# EAGLE design Domino Pi No Teardrop (EAGLE 6.5.0)
Domino breakout Board
DATABASE: ./BOM/Domino_DB.txt; DRAWN: M.STEMPIN; REV: A
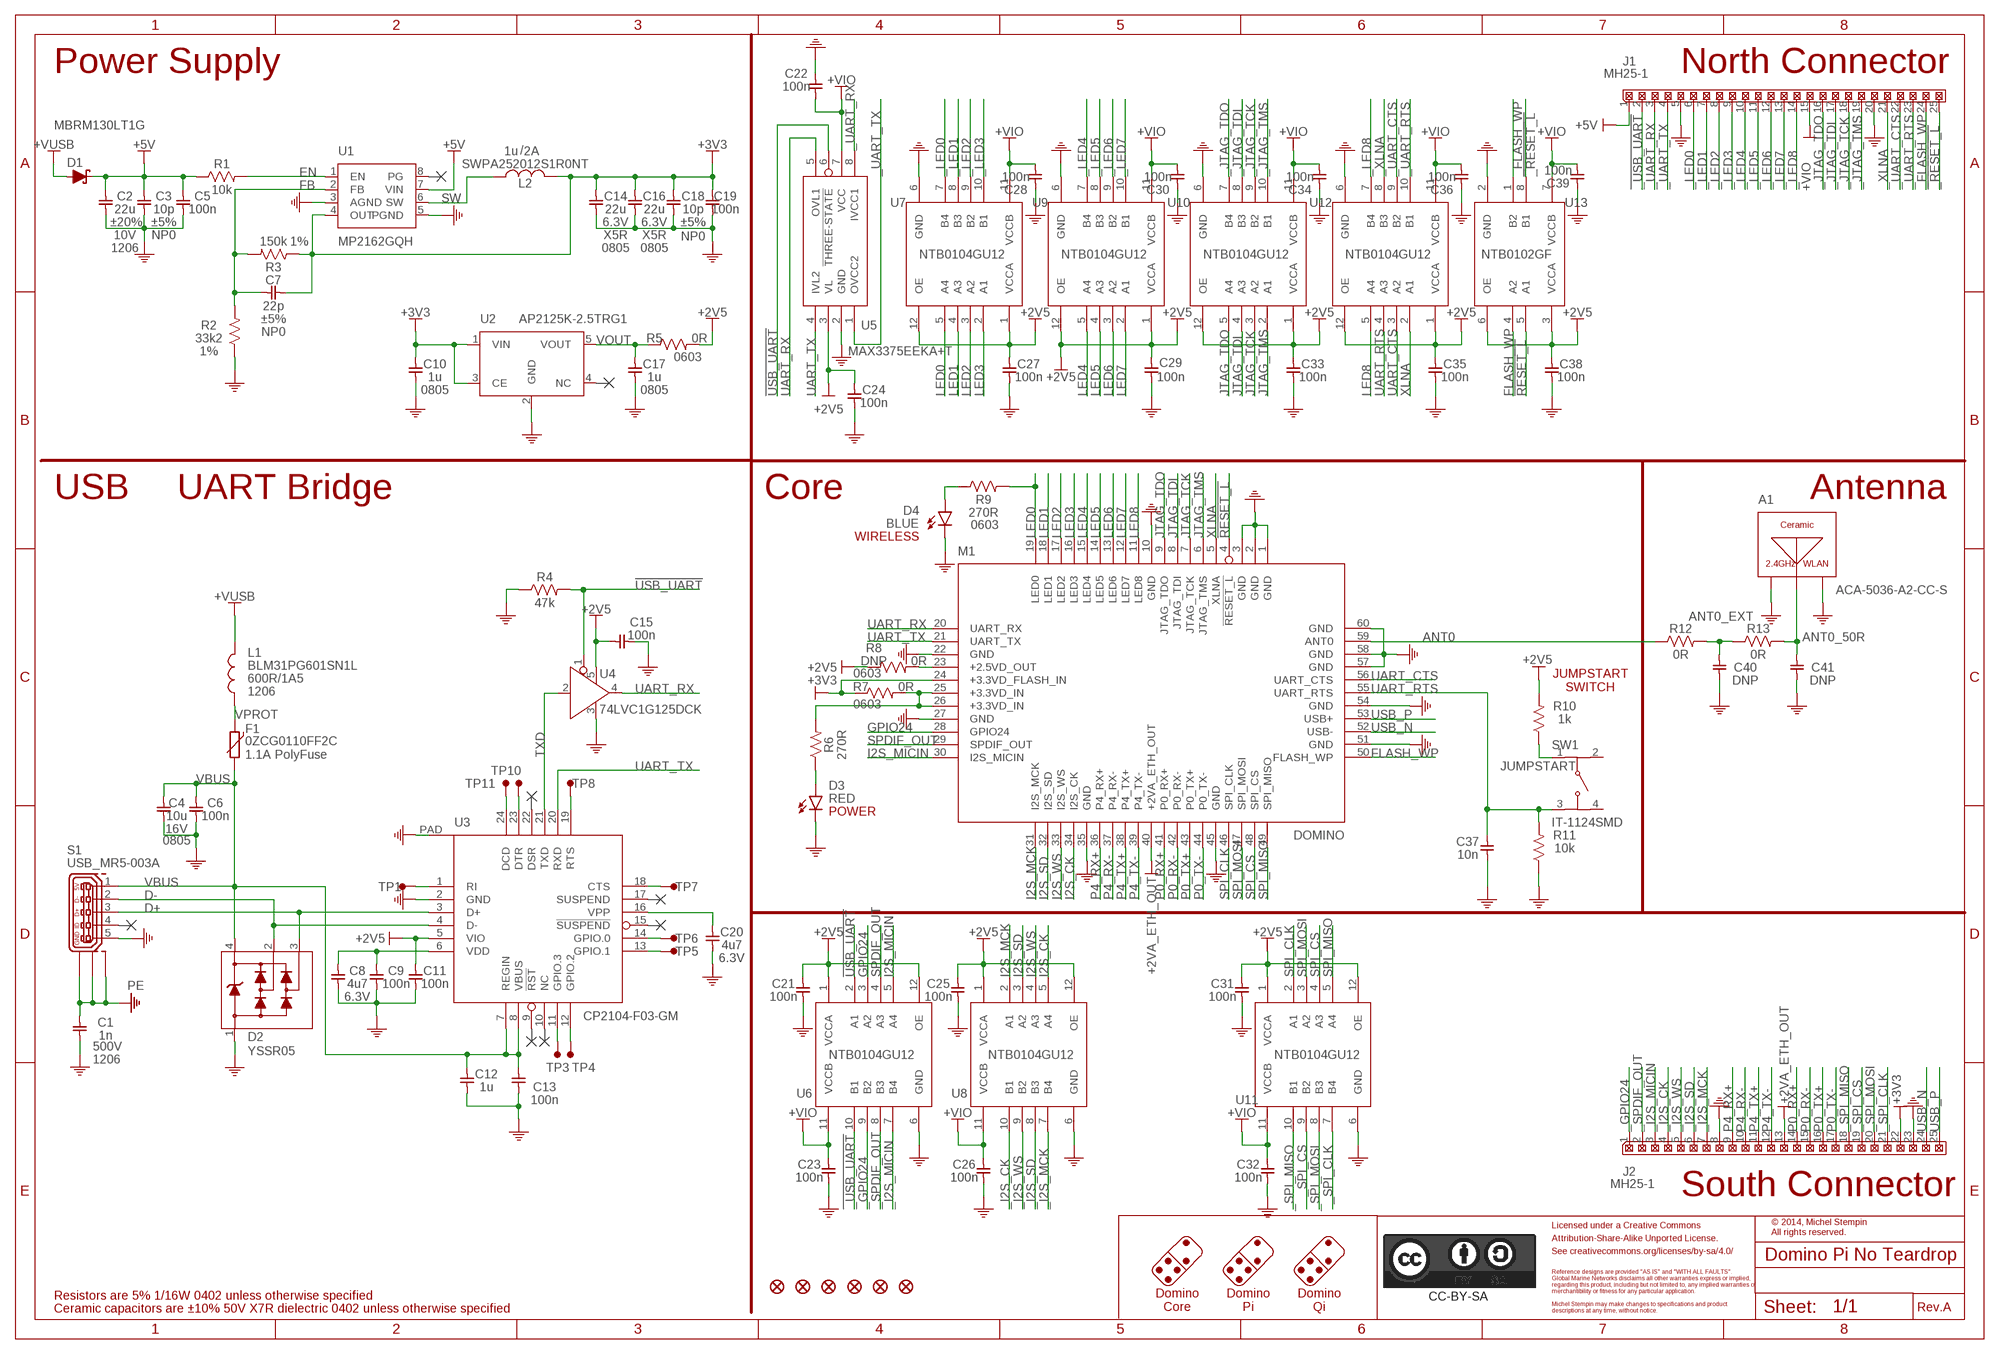
[diagram p0: schematic, sheet 1]
PORT1 (NC): BOM: EXCLUDE
PORT2 (NC): BOM: EXCLUDE
PORT3 (NC): BOM: EXCLUDE
PORT7 (NC): BOM: EXCLUDE
PORT8 (NC): BOM: EXCLUDE
PORT13 (NC): BOM: EXCLUDE
PORT16 (NC): BOM: EXCLUDE
PORT17 (NC): BOM: EXCLUDE

## Parts
A1  ACA-5036-A2-CC-S  [ACA-5036-A2-CC-S]
C1  1n  CAP_1206  [C1206]
C2  22u  CAP_1206  [C1206]
C3  10p  CAP_0402  [C0402]
C4  10u  CAP_0805  [C0805]
C5  100n  CAP_0402  [C0402]
C6  100n  CAP_0402  [C0402]
C7  22p  CAP_0402  [C0402]
C8  4u7  CAP_0402  [C0402]
C9  100n  CAP_0402  [C0402]
C10  1u  CAP_0805  [C0805]
C11  100n  CAP_0402  [C0402]
C12  1u  CAP_0402  [C0402]
C13  100n  CAP_0402  [C0402]
C14  22u  CAP_0805  [C0805]
C15  100n  CAP_0402  [C0402]
C16  22u  CAP_0805  [C0805]
C17  1u  CAP_0805  [C0805]
C18  10p  CAP_0402  [C0402]
C19  100n  CAP_0402  [C0402]
C20  4u7  CAP_0402  [C0402]
C21  100n  CAP_0402  [C0402]
C22  100n  CAP_0402  [C0402]
C23  100n  CAP_0402  [C0402]
C24  100n  CAP_0402  [C0402]
C25  100n  CAP_0402  [C0402]
C26  100n  CAP_0402  [C0402]
C27  100n  CAP_0402  [C0402]
C28  100n  CAP_0402  [C0402]
C29  100n  CAP_0402  [C0402]
C30  100n  CAP_0402  [C0402]
C31  100n  CAP_0402  [C0402]
C32  100n  CAP_0402  [C0402]
C33  100n  CAP_0402  [C0402]
C34  100n  CAP_0402  [C0402]
C35  100n  CAP_0402  [C0402]
C36  100n  CAP_0402  [C0402]
C37  10n  CAP_0402  [C0402]
C38  100n  CAP_0402  [C0402]
C39  100n  CAP_0402  [C0402]
C40  DNP  CAP_0402  [C0402]
C41  DNP  CAP_0402  [C0402]
CC-BY-SA  CC-BY-SA_LOGO  [CC-BY-SA_LOGO]
D1  MBRM130LT1G  [DO-216AA]
D2  YSSR05  [SOT143B]
D3  RED  LED_0603  [LED0603]
D4  BLUE  LED_0603  [LED0603]
F1  0ZCG0110FF2C  [PTC1812]
F2  FIDUCIAL  [FIDUCIAL]
F3  FIDUCIAL  [FIDUCIAL]
F4  FIDUCIAL  [FIDUCIAL]
F5  FIDUCIAL  [FIDUCIAL]
F6  FIDUCIAL  [FIDUCIAL]
F7  FIDUCIAL  [FIDUCIAL]
J1  MH25-1  [MH25-1-0.1]
J2  MH25-1  [MH25-1-0.1]
L1  BLM31PG601SN1L  FB_1206  [FB1206]
L2  SWPA252012S1R0NT  [SWPA252012S]
M1  DOMINO  [DOMINO]
R1  10k  RES_0402  [R0402]
R2  33k2  RES_0402  [R0402]
R3  150k  RES_0402  [R0402]
R4  47k  RES_0402  [R0402]
R5  0R  RES_0603  [R0603]
R6  270R  RES_0402  [R0402]
R7  0R  RES_0603  [R0603]
R8  0R  RES_0603  [R0603]
R9  270R  RES_0603  [R0603]
R10  1k  RES_0402  [R0402]
R11  10k  RES_0402  [R0402]
R12  0R  RES_0402  [R0402]
R13  0R  RES_0402  [R0402]
S1  USB_MR5-003A  [USB_MR5-003A]
SW1  IT-1124SMD  [IT-1124SMD]
TP1  TEST_PAD  [TEST_PAD]
TP3  TEST_PAD  [TEST_PAD]
TP4  TEST_PAD  [TEST_PAD]
TP5  TEST_PAD  [TEST_PAD]
TP6  TEST_PAD  [TEST_PAD]
TP7  TEST_PAD  [TEST_PAD]
TP8  TEST_PAD  [TEST_PAD]
TP10  TEST_PAD  [TEST_PAD]
TP11  TEST_PAD  [TEST_PAD]
U1  MP2162GQH  [QFN-8_2X1.5]
U2  AP2125K-2.5TRG1  [SOT23-5]
U3  CP2104-F03-GM  [QFN-25_4X4]
U4  74LVC1G125DCK  [SC70]
U5  MAX3375EEKA+T  [SOT23-8]
U6  NTB0104GU12  [XQFN-12]
U7  NTB0104GU12  [XQFN-12]
U8  NTB0104GU12  [XQFN-12]
U9  NTB0104GU12  [XQFN-12]
U10  NTB0104GU12  [XQFN-12]
U11  NTB0104GU12  [XQFN-12]
U12  NTB0104GU12  [XQFN-12]
U13  NTB0102GF  [SOT1089]

## Nets
!_RESET_L: J1.25 U13.8(B1)
!_USB_UART: J1.2 U6.10(B1)
!RESET_L: M1.4(!RESET_L) U13.5(A1)
!USB_UART: R4.2 U4.1(!OE) U5.6(!THREE-STATE) U6.2(A1)
+2.5VD_OUT: M1.23(+2.5VD_OUT) R8.2
+2V5: C11.1 C15.2 C21.1 C24.2 C25.1 C27.2 C29.2 C31.1 C33.2 C35.2 C38.2 R5.2 R8.1 R10.2 U3.5(VIO) U4.5(VCC) U5.3(VL) U6.1(VCCA) U6.12(OE) U7.1(VCCA) U7.12(OE) U8.1(VCCA) U8.12(OE) U9.1(VCCA) U9.12(OE) U10.1(VCCA) U10.12(OE) U11.1(VCCA) U11.12(OE) U12.1(VCCA) U12.12(OE) U13.3(VCCA) U13.6(OE)
+2VA_ETH_OUT [Ethernet]: J2.13 M1.40(+2VA_ETH_OUT)
+3.3VD_IN: M1.25(+3.3VD_IN) M1.26(+3.3VD_IN) R6.2 R7.2
+3V3: C7.2 C10.1 C14.1 C16.1 C18.1 C19.1 J2.22 L2.2 M1.24(+3.3VD_FLASH_IN) R3.1 R7.1 U1.4(OUT) U2.1(VIN) U2.3(CE)
+5V: C2.1 C3.1 C5.1 D1.1(C) J1.1 R1.1 U1.7(VIN)
+VIO: C22.1 C23.1 C26.1 C28.1 C30.1 C32.1 C34.1 C36.1 C39.1 J1.15 U5.7(VCC) U6.11(VCCB) U7.11(VCCB) U8.11(VCCB) U9.11(VCCB) U10.11(VCCB) U11.11(VCCB) U12.11(VCCB) U13.7(VCCB)
+VUSB: D1.2(A) L1.1
_FLASH_WP: J1.24 U13.1(B2)
_GPIO24: J2.1 U6.9(B2)
_I2S_CK: J2.4 U8.10(B1)
_I2S_MCK: J2.7 U8.7(B4)
_I2S_MICIN: J2.3 U6.7(B4)
_I2S_SD: J2.6 U8.8(B3)
_I2S_WS: J2.5 U8.9(B2)
_JTAG_TCK: J1.18 U10.9(B2)
_JTAG_TDI: J1.17 U10.8(B3)
_JTAG_TDO: J1.16 U10.7(B4)
_JTAG_TMS: J1.19 U10.10(B1)
_LED0: J1.6 U7.7(B4)
_LED1: J1.7 U7.8(B3)
_LED2: J1.8 U7.9(B2)
_LED3: J1.9 U7.10(B1)
_LED4: J1.10 U9.7(B4)
_LED5: J1.11 U9.8(B3)
_LED6: J1.12 U9.9(B2)
_LED7: J1.13 U9.10(B1)
_LED8: J1.14 U12.7(B4)
_SPDIF_OUT: J2.2 U6.8(B3)
_SPI_CLK: J2.21 U11.7(B4)
_SPI_CS: J2.19 U11.9(B2)
_SPI_MISO: J2.18 U11.10(B1)
_SPI_MOSI: J2.20 U11.8(B3)
_UART_CTS: J1.22 U12.9(B2)
_UART_RTS: J1.23 U12.10(B1)
_UART_RX: J1.3 U5.8(IVCC1)
_UART_TX: J1.4 U5.1(OVCC2)
_XLNA: J1.21 U12.8(B3)
ANT0 [RF]: M1.59(ANT0) R12.1
ANT0_50R: A1.FEED(A) C41.1 R13.2
ANT0_EXT [RF]: C40.1 R12.2 R13.1
BLUE_LED: D4.2(A) R9.1
D+: D2.3 S1.3 U3.3(D+)
D-: D2.2 S1.2 U3.4(D-)
EN: R1.2 U1.1(EN)
FB: C7.1 R2.2 R3.2 U1.2(FB)
FLASH_WP: M1.50(FLASH_WP) U13.4(A2)
GND: A1.GND$1(GND) A1.GND$2(GND) C1.2 C2.2 C3.2 C4.2 C5.2 C6.2 C8.2 C9.2 C10.2 C11.2 C12.2 C13.2 C14.2 C15.1 C16.2 C17.2 C18.2 C19.2 C20.2 C21.2 C22.2 C23.2 C24.1 C25.2 C26.2 C27.1 C28.2 C29.1 C30.2 C31.2 C32.2 C33.1 C34.2 C35.1 C36.2 C37.2 C38.1 C39.2 C40.2 C41.2 D2.1 D3.1(C) D4.1(C) J1.5 J1.20 J2.8 J2.23 M1.1(GND) M1.2(GND) M1.3(GND) M1.10(GND) M1.22(GND) M1.27(GND) M1.35(GND) M1.45(GND) M1.51(GND) M1.54(GND) M1.57(GND) M1.58(GND) M1.60(GND) R2.1 R4.1 R11.1 S1.5 U1.3(AGND) U1.5(PGND) U2.2(GND) U3.2(GND) U3.PAD U4.3(GND) U5.2(GND) U6.6(GND) U7.6(GND) U8.6(GND) U9.6(GND) U10.6(GND) U11.6(GND) U12.6(GND) U13.2(GND)
GPIO24: M1.28(GPIO24) U6.3(A2)
I2S_CK: M1.34(I2S_CK) U8.5(A4)
I2S_MCK: M1.31(I2S_MCK) U8.2(A1)
I2S_MICIN: M1.30(I2S_MICIN) U6.5(A4)
I2S_SD: M1.32(I2S_SD) U8.3(A2)
I2S_WS: M1.33(I2S_WS) U8.4(A3)
JTAG_TCK: M1.7(JTAG_TCK) U10.3(A2)
JTAG_TDI: M1.8(JTAG_TDI) U10.4(A3)
JTAG_TDO: M1.9(JTAG_TDO) U10.5(A4)
JTAG_TMS: M1.6(JTAG_TMS) U10.2(A1)
JUMPSTART: R10.1 SW1.1
LED0: M1.19(LED0) R9.2 U7.5(A4)
LED1: M1.18(LED1) U7.4(A3)
LED2: M1.17(LED2) U7.3(A2)
LED3: M1.16(LED3) U7.2(A1)
LED4: M1.15(LED4) U9.5(A4)
LED5: M1.14(LED5) U9.4(A3)
LED6: M1.13(LED6) U9.3(A2)
LED7: M1.12(LED7) U9.2(A1)
LED8: M1.11(LED8) U12.5(A4)
N$1: D3.2(A) R6.1
N$6: TP1.1(PP) U3.1(RI)
N$8: TP3.1(PP) U3.11(GPIO.3)
N$9: TP4.1(PP) U3.12(GPIO.2)
N$10: TP7.1(PP) U3.18(CTS)
N$12: TP10.1(PP) U3.23(DTR)
N$13: TP11.1(PP) U3.24(DCD)
N$14: TP8.1(PP) U3.19(RTS)
N$15: TP6.1(PP) U3.14(GPIO.0)
N$16: TP5.1(PP) U3.13(GPIO.1)
N$31: C20.1 U3.16(VPP)
P0_RX+ [Ethernet]: J2.14 M1.41(P0_RX+)
P0_RX- [Ethernet]: J2.15 M1.42(P0_RX-)
P0_TX+ [Ethernet]: J2.16 M1.43(P0_TX+)
P0_TX- [Ethernet]: J2.17 M1.44(P0_TX-)
P4_RX+ [Ethernet]: J2.9 M1.36(P4_RX+)
P4_RX- [Ethernet]: J2.10 M1.37(P4_RX-)
P4_TX+ [Ethernet]: J2.11 M1.38(P4_TX+)
P4_TX- [Ethernet]: J2.12 M1.39(P4_TX-)
PE: C1.1 S1.S$1(M0) S1.S$2(M1) S1.S$3(M2)
SPDIF_OUT: M1.29(SPDIF_OUT) U6.4(A3)
SPI_CLK: M1.46(SPI_CLK) U11.2(A1)
SPI_CS: M1.48(SPI_CS) U11.4(A3)
SPI_MISO: M1.49(SPI_MISO) U11.5(A4)
SPI_MOSI: M1.47(SPI_MOSI) U11.3(A2)
SW: L2.1 U1.6(SW)
TXD: U3.21(TXD) U4.2(A)
UART_CTS: M1.56(UART_CTS) U12.3(A2)
UART_RTS: C37.1 M1.55(UART_RTS) R11.2 SW1.3 U12.4(A3)
UART_RX: M1.20(UART_RX) U4.4(Y) U5.5(OVL1)
UART_TX: M1.21(UART_TX) U3.20(RXD) U5.4(IVL2)
USB_N [USB]: J2.24 M1.52(USB-)
USB_P [USB]: J2.25 M1.53(USB+)
VBUS: C4.1 C6.1 C12.1 C13.1 D2.4 F1.2 S1.1 U3.7(REGIN) U3.8(VBUS)
VDD: C8.1 C9.1 U3.6(VDD)
VOUT: C17.1 R5.1 U2.5(VOUT)
VPROT: F1.1 L1.2
XLNA: M1.5(XLNA) U12.2(A1)
Unconnected: S1.4 SW1.2 SW1.4 U1.8(PG) U2.4(NC) U3.9(!RST) U3.10(NC) U3.15(!SUSPEND) U3.17(SUSPEND) U3.22(DSR)

## Notes on the sheet
- Power Supply | North Connector
- /
- USB ⇔ UART Bridge | Core | Antenna
- WIRELESS
- JUMPSTART
  SWITCH
- PolyFuse
- POWER
- South Connector
- Licensed under a Creative Commons
- © 2014, Michel Stempin
  All rights reserved.
- Attribution-Share-Alike Unported License.
- See creativecommons.org/licenses/by-sa/4.0/
- Reference designs are provided "AS IS" and "WITH ALL FAULTS".
- Global Marine Networks disclaims all other warranties express or implied,
- regarding this product, including but not limited to, any implied warranties of
- merchantibility or fitness for any particular application.
- Resistors are 5% 1/16W 0402 unless otherwise specified
- Domino
  Core
- Domino
  Pi
- Domino
  Qi
- Michel Stempin may make changes to specifications and product
- Ceramic capacitors are ±10% 50V X7R dielectric 0402 unless otherwise specified | descriptions at any time, without notice. | Rev.

## Library data of the parts
A1 = Domino:ACA-5036-A2-CC-S: 2.4GHz ISM Band Chip Antenna; PARTNO: ACA-5036-A2-CC-S
C1 = Domino:CAP_: Capacitor; PARTNO: C1206_1n_X7R_10%_CER_500V; SIZE: 1206; TC: X7R; TOL: ±10%; TYPE: CER; VOLT: 500V
C2 = Domino:CAP_: Capacitor; PARTNO: C1206_22u_X7R_20%_CER_10V; SIZE: 1206; TC: X7R; TOL: ±20%; TYPE: CER; VOLT: 10V
C3 C18 = Domino:CAP_: Capacitor; PARTNO: C0402_10p_NP0_5%_CER_50V; SIZE: 0402; TC: NP0; TOL: ±5%; TYPE: CER; VOLT: 50V
C4 = Domino:CAP_: Capacitor; PARTNO: C0805_10u_X7R_10%_CER_16V; SIZE: 0805; TC: X7R; TOL: ±10%; TYPE: CER; VOLT: 16V
C5 C6 C9 C11 C13 C15 C19 C21-C36 C38 C39 = Domino:CAP_: Capacitor; PARTNO: C0402_100n_X7R_10%_CER_50V; SIZE: 0402; TC: X7R; TOL: ±10%; TYPE: CER; VOLT: 50V
C7 = Domino:CAP_: Capacitor; PARTNO: C0402_22p_NP0_5%_CER_50V; SIZE: 0402; TC: NP0; TOL: ±5%; TYPE: CER; VOLT: 50V
C8 C20 = Domino:CAP_: Capacitor; PARTNO: C0402_4u7_X7R_10%_CER_6V3; SIZE: 0402; TC: X7R; TOL: ±10%; TYPE: CER; VOLT: 6.3V
C10 C17 = Domino:CAP_: Capacitor; PARTNO: C0805_1u_X7R_10%_CER_50V; SIZE: 0805; TC: X7R; TOL: ±10%; TYPE: CER; VOLT: 50V
C12 = Domino:CAP_: Capacitor; PARTNO: C0402_1u_X7R_10%_CER_50V; SIZE: 0402; TC: X7R; TOL: ±10%; TYPE: CER; VOLT: 50V
C14 C16 = Domino:CAP_: Capacitor; PARTNO: C0805_22u_X5R_20%_CER_6V3; SIZE: 0805; TC: X5R; TOL: ±20%; TYPE: CER; VOLT: 6.3V
C37 = Domino:CAP_: Capacitor; PARTNO: C0402_10n_X7R_10%_CER_50V; SIZE: 0402; TC: X7R; TOL: ±10%; TYPE: CER; VOLT: 50V
C40 C41 = Domino:CAP_: Capacitor; DNP: T; PARTNO: C0402_DNP; SIZE: 0402
CC-BY-SA = Domino:CC-BY-SA_LOGO: Attribution-Share-Alike Unported License See creativecommons.org/licenses/by-sa/3.0/ for details.; BOM: EXCLUDE
D1 = Domino:MBRM130: Schottky Barrier Rectifier, 1A, 30V; PARTNO: MBRM130LT1G; RATE: 1A; VOLT: 30V
D2 = Domino:YSSR05: Ultra low capacitance double rail-to-rail ESD protection diode; PARTNO: YSSR05; RATE: 300W; VOLT: 5V
D3 = Domino:LED_: LED; PARTNO: LED0603-RED
D4 = Domino:LED_: LED; PARTNO: LED0603-BLUE
F1 = Domino:0ZCG: Bel 0ZCG Series Surface Mount PTC; PARTNO: 0ZCG0110FF2C; RATE: 1.1A; VOLT: 8V
F2-F7 = Domino:FIDUCIAL: Fiducial Mark Copyright © 2012, Michel Stempin, All rights reserved Licenced under Creative Commons CC BY-SA 3.0 <http://creativecommons.org/licenses/by-sa/3.0/deed.en> license.; BOM: EXCLUDE
J1 J2 = Domino:MH25-1: 25x1 Pin Male Header; PARTNO: MH25-1-0.1
L1 = Domino:FB_: Ferrite Bead; OPT: 600R/1A5; PARTNO: BLM31PG601SN1L; SIZE: 1206
L2 = Domino:SWPA252012S*?: 2.0 x 1.5 mm Footprint 1.2mm Height Shielded Inductor; INDUCTANCE: 1u; PARTNO: SWPA252012SMT; RATE: 2A; TOL: ±30%
M1 = Domino:DOMINO: GL-Connect Domino WiFi Module; PARTNO: DOMINO-CORE
R1 R11 = Domino:RES_: Resistor; PARTNO: R0402_10k_5%_62.5mW; RATE: 62.5mW; SIZE: 0402; TOL: 5%
R2 = Domino:RES_: Resistor; PARTNO: R0402_33k2_1%_62.5mW; RATE: 62.5mW; SIZE: 0402; TOL: 1%
R3 = Domino:RES_: Resistor; PARTNO: R0402_150k_1%_62.5mW; RATE: 62.5mW; SIZE: 0402; TOL: 1%
R4 = Domino:RES_: Resistor; PARTNO: R0402_47k_5%_62.5mW; RATE: 62.5mW; SIZE: 0402; TOL: 5%
R5 R7 = Domino:RES_: Resistor; PARTNO: R0603_0R_5%_125mW; RATE: 125mW; SIZE: 0603; TOL: 5%
R6 = Domino:RES_: Resistor; PARTNO: R0603_270R_5%_125mW; RATE: 125mW; SIZE: 0402; TOL: 5%
R8 = Domino:RES_: Resistor; DNP: T; PARTNO: R0603_0R_5%_125mW; RATE: 125mW; SIZE: 0603; TOL: 5%
R9 = Domino:RES_: Resistor; PARTNO: R0603_270R_5%_125mW; RATE: 125mW; SIZE: 0603; TOL: 5%
R10 = Domino:RES_: Resistor; PARTNO: R0402_1k_5%_62.5mW; RATE: 62.5mW; SIZE: 0402; TOL: 5%
R12 R13 = Domino:RES_: Resistor; PARTNO: R0402_0R_5%_62.5mW; RATE: 62.5mW; SIZE: 0402; TOL: 5%
S1 = Domino:USB_MR5-003: Micro USB Type B Receptacle, 3 Shield Pins; PARTNO: USB MR5-003A
SW1 = Domino:IT-1124SMD: SPST Tact Switch; PARTNO: IT-1124SMD
TP1 TP3-TP8 TP10 TP11 = Domino:TEST_PAD: Test Pad; BOM: EXCLUDE
U1 = Domino:MP2162: 2A, 6V, 1.5MHz Synchronous Step-Down Switcher; PARTNO: MP2162GQH
U2 = Domino:AP2125?*: 300mA High-Speed, Extremely Low Noise CMOS LDO Regulator; PARTNO: AP2125K-2.5TRG1; RATE: 0.3A; VOLT: 2.5V
U3 = Domino:CP2104-: Single-Chip USB-to-UART Bridge; PARTNO: CP2104-F03-GM
U4 = Domino:74*1G125: Single Bus Buffer Gate With 3-State Output; PARTNO: 74LVC1G125DCK
U5 = Domino:MAX3375E: Dual Low-Voltage Level Translators; PARTNO: MAX3375EEKA+T
U6-U12 = Domino:NTB0104: Dual supply translating transceiver; auto direction sensing; 3-state; PARTNO: NTB0104GU12
U13 = Domino:NTB0102: Dual supply translating transceiver; auto direction sensing; 3-state; PARTNO: NTB0102GF

## Net classes
1 USB: width 0.254 mm, clearance 0.127 mm
2 RF: width 0.66 mm, clearance 0.152 mm
3 Ethernet: width 0.178 mm, clearance 0.152 mm to class 0, clearance 0.127 mm

## Board
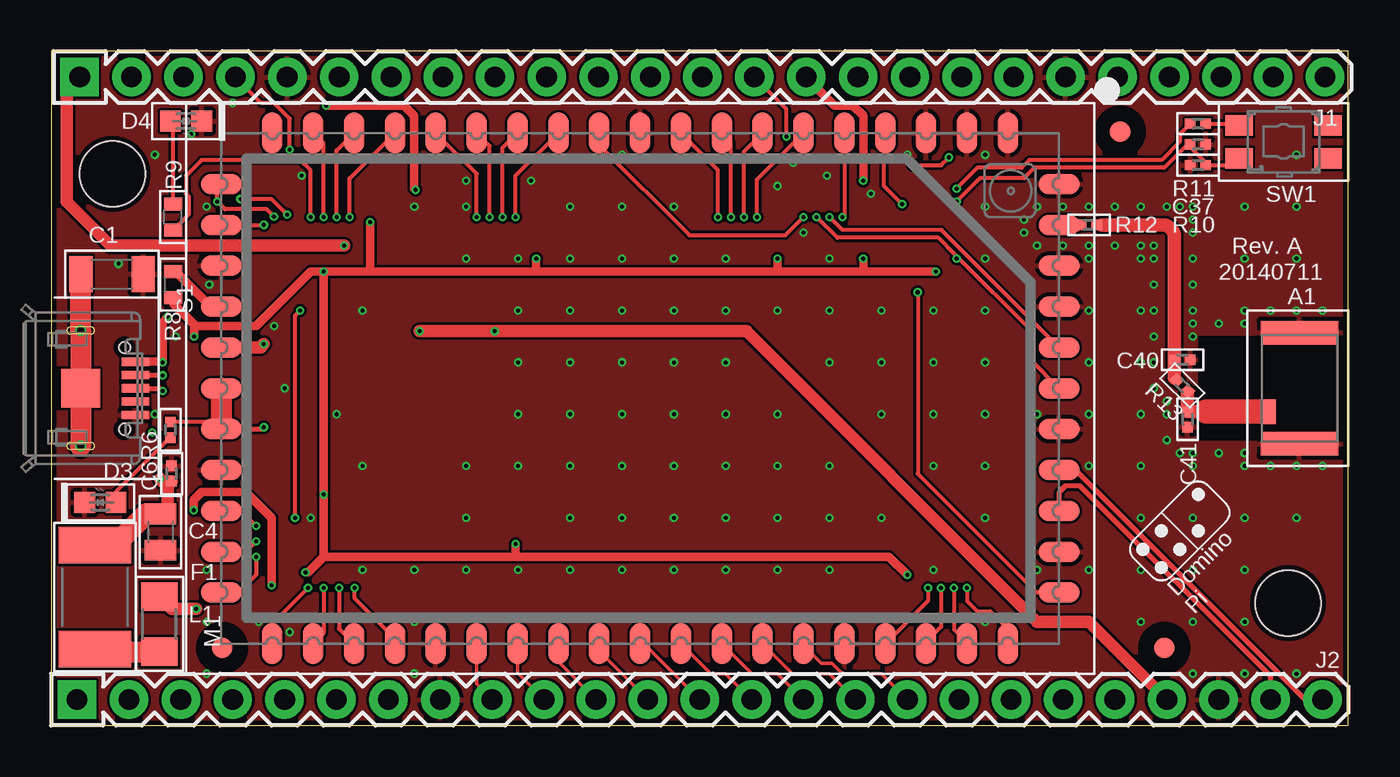
[diagram p1: board, top side]
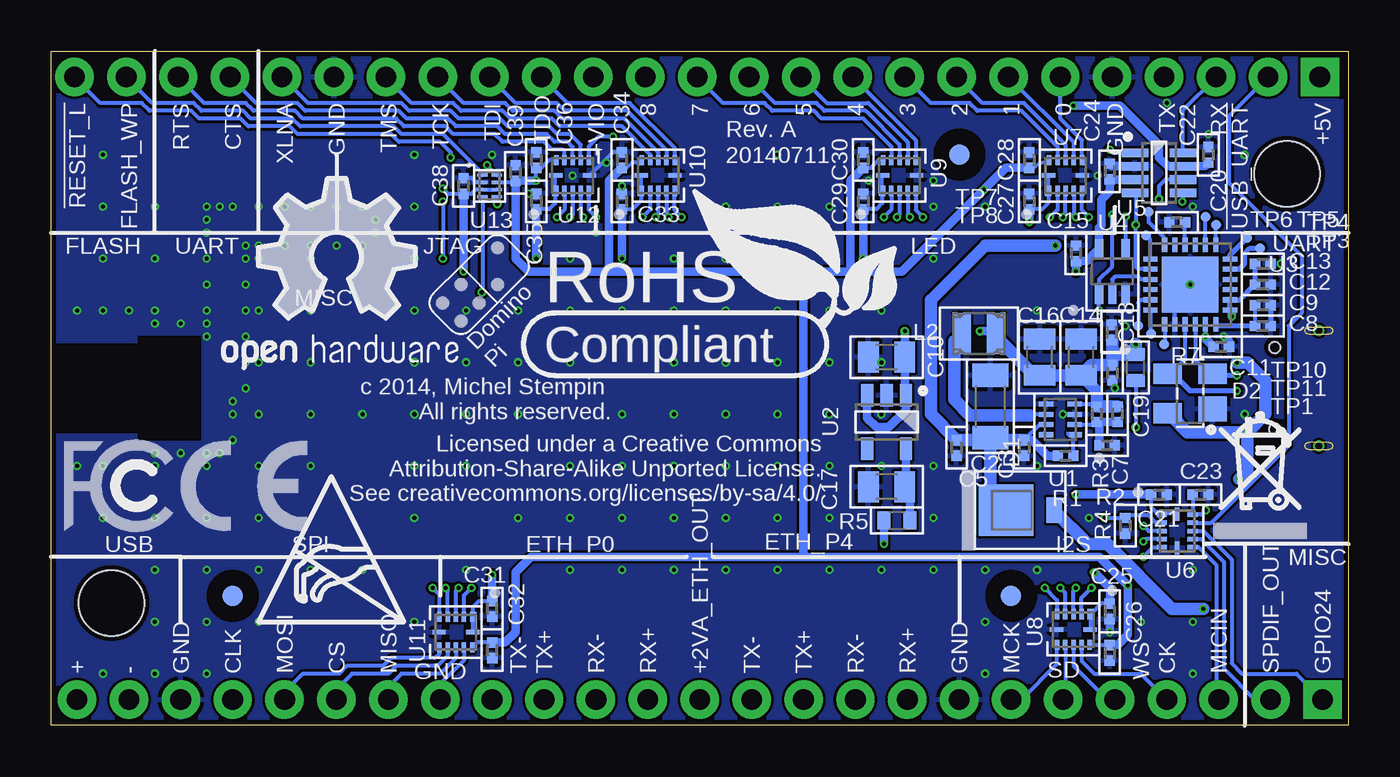
[diagram p2: board, bottom side, seen from below]

Size 63.5 x 33.02 mm. Coordinates in mm from the lower left corner, seen from the top.
Outline: 0,0 63.5,0 63.5,33.02 0,33.02 0,0
Copper layers (1*16): Top 0.043mm / dielectric 1mm / Bottom 0.043mm
Design rules "Domino *": minimum track width 0.1mm, minimum drill 0.2mm, track to track 0.125mm, track to pad 0.125mm, pad to pad 0.125mm, via to via 0.125mm, smd to smd 0mil, copper to edge 0.25mm, drill to drill 0.35mm, minimum pad ring 0.085mm, minimum via ring 0.1mm, stop-mask expansion 0mil, vias tented up to drill 0.45mm, thermal gap 0.2mm
Holes 3.2 mm at 60.54,6 3,27

### Footprints (pad centres in the part's own frame; a part is rotated, then mirrored left to right if it is on the bottom)
ACA-5036-A2-CC-S = smd 1.2 x 0.75: FEED 1.15,-1.525 | smd 1.15 x 3.8: GND$1 -2.725,0; GND$2 2.725,0
C1206 = smd 1.143 x 1.778: 1 -1.524,0; 2 1.524,0
C0402 = smd 0.508 x 0.508: 1 -0.381,0; 2 0.381,0
C0805 = smd 1.016 x 1.524: 1 -0.889,0; 2 0.889,0
DO-216AA = smd 2.667 x 2.54: 1 -1.651,0 | smd 0.762 x 1.27: 2 0.699,0
SOT143B = smd 1.2 x 1.4: 1 -0.76,-1.1 | smd 1 x 1.4: 2 0.96,-1.1; 3 0.96,1.1; 4 -0.96,1.1
LED0603 = smd 1.016 x 1.016: 1 -0.762,0; 2 0.762,0
PTC1812 = smd 1.778 x 3.556: 1 -2.54,0; 2 2.54,0
FIDUCIAL = smd 1.016 x 1.016: 1 0,0
MH25-1-0.1 = drill 1.016 pad 1.88 square: 1 0,0 | drill 1.016 pad 1.88: 2 2.54,0; 3 5.08,0; 4 7.62,0; 5 10.16,0; 6 12.7,0; 7 15.24,0; 8 17.78,0; 9 20.32,0; 10 22.86,0; 11 25.4,0; 12 27.94,0; 13 30.48,0; 14 33.02,0; 15 35.56,0; 16 38.1,0; 17 40.64,0; 18 43.18,0; 19 45.72,0; 20 48.26,0; 21 50.8,0; 22 53.34,0; 23 55.88,0; 24 58.42,0; 25 60.96,0
FB1206 = smd 1.4 x 1.8: 1 -1.35,0; 2 1.35,0
SWPA252012S = smd 2 x 0.85: 1 0,0.825; 2 0,-0.825
DOMINO = smd 2 x 1: 1 -12.5,18; 2 -12.5,16; 3 -12.5,14; 4 -12.5,12; 5 -12.5,10; 6 -12.5,8; 7 -12.5,6; 8 -12.5,4; 9 -12.5,2; 10 -12.5,0; 11 -12.5,-2; 12 -12.5,-4; 13 -12.5,-6; 14 -12.5,-8; 15 -12.5,-10; 16 -12.5,-12; 17 -12.5,-14; 18 -12.5,-16; 19 -12.5,-18; 31 12.5,-18; 32 12.5,-16; 33 12.5,-14; 34 12.5,-12; 35 12.5,-10; 36 12.5,-8; 37 12.5,-6; 38 12.5,-4; 39 12.5,-2; 40 12.5,0; 41 12.5,2; 42 12.5,4; 43 12.5,6; 44 12.5,8; 45 12.5,10; 46 12.5,12; 47 12.5,14; 48 12.5,16; 49 12.5,18 | smd 1 x 2: 20 -10,-20.5; 21 -8,-20.5; 22 -6,-20.5; 23 -4,-20.5; 24 -2,-20.5; 25 0,-20.5; 26 2,-20.5; 27 4,-20.5; 28 6,-20.5; 29 8,-20.5; 30 10,-20.5; 50 10,20.5; 51 8,20.5; 52 6,20.5; 53 4,20.5; 54 2,20.5; 55 0,20.5; 56 -2,20.5; 57 -4,20.5; 58 -6,20.5; 59 -8,20.5; 60 -10,20.5
R0402 = smd 0.508 x 0.508: 1 -0.381,0; 2 0.381,0
R0603 = smd 0.635 x 0.889: 1 -0.635,0; 2 0.635,0
USB_MR5-003A = smd 0.4 x 1.35: 1 -1.3,2.675; 2 -0.65,2.675; 3 0,2.675; 4 0.65,2.675; 5 1.3,2.675 | drill 0.35: S$1 -2.825,0; S$2 2.825,0 | smd 1.9 x 1.9: S$3 0,0 | hole 0.55: -2,2.15; 2,2.15
IT-1124SMD = smd 1.35 x 1: 1 -2.175,0.8; 2 2.175,0.8; 3 -2.175,-0.8; 4 2.175,-0.8
TEST_PAD = smd 0.5 x 0.5: 1 0,0
QFN-8_2X1.5 = smd 0.6 x 0.25: 1 -0.75,0.75 | smd 0.7 x 0.25: 2 -0.7,0.25; 3 -0.7,-0.25; 4 -0.7,-0.75; 5 0.7,-0.75; 6 0.7,-0.25; 7 0.7,0.25; 8 0.7,0.75
SOT23-5 = smd 0.6 x 1.1: 1 -0.95,-1.3; 2 0,-1.3; 3 0.95,-1.3; 4 0.95,1.3; 5 -0.95,1.3
QFN-25_4X4 = smd 0.7 x 0.25: 1 -1.95,1.25; 2 -1.95,0.75; 3 -1.95,0.25; 4 -1.95,-0.25; 5 -1.95,-0.75; 6 -1.95,-1.25; 13 1.95,-1.25; 14 1.95,-0.75; 15 1.95,-0.25; 16 1.95,0.25; 17 1.95,0.75; 18 1.95,1.25 | smd 0.25 x 0.7: 7 -1.25,-1.95; 8 -0.75,-1.95; 9 -0.25,-1.95; 10 0.25,-1.95; 11 0.75,-1.95; 12 1.25,-1.95; 19 1.25,1.95; 20 0.75,1.95; 21 0.25,1.95; 22 -0.25,1.95; 23 -0.75,1.95; 24 -1.25,1.95 | smd 2.75 x 2.75: PAD 0,0
SC70 = smd 0.4 x 1: 1 -0.65,-1.1; 2 0,-1.1; 3 0.65,-1.1; 4 0.65,1.1; 5 -0.65,1.1
SOT23-8 = smd 0.42 x 1.3: 1 -0.975,-1.175; 2 -0.325,-1.175; 3 0.325,-1.175; 4 0.975,-1.175; 5 0.975,1.175; 6 0.325,1.175; 7 -0.325,1.175; 8 -0.975,1.175
XQFN-12 = smd 0.5 x 0.32: 1 -0.75,0.85 | smd 0.5 x 0.22: 2 -0.75,0.4; 3 -0.75,0; 4 -0.75,-0.4; 5 -0.75,-0.8; 7 0.75,-0.8; 8 0.75,-0.4; 9 0.75,0; 10 0.75,0.4; 11 0.75,0.8 | smd 0.22 x 0.65: 6 0,-0.825; 12 0,0.825
SOT1089 = smd 0.15 x 0.5: 1 -0.525,-0.35; 2 -0.175,-0.35; 3 0.175,-0.35; 4 0.525,-0.35; 5 0.525,0.35; 6 0.175,0.35; 7 -0.175,0.35; 8 -0.525,0.35

### Placement (x,y rotation side)
A1  61.1,16.51 270 top
C1  2.98,22.1 0 top
C2  17.53,15.62 90 bottom
C3  15.88,13.59 270 bottom
C4  5.36,9.47 270 top
C5  19.18,13.59 270 bottom
C6  5.9,12.34 90 top
C7  11.3,15.24 90 bottom
C8  4.19,19.56 0 bottom
C9  4.19,20.57 0 bottom
C10  22.61,18.03 180 bottom
C11  6.22,18.54 0 bottom
C12  4.19,21.59 0 bottom
C13  4.19,22.61 0 bottom
C14  13.08,18.03 90 bottom
C15  13.34,23.11 270 bottom
C16  15.11,18.03 90 bottom
C17  22.61,11.68 180 bottom
C18  11.58,19.24 90 bottom
C19  11.56,17.27 270 bottom
C20  8.38,24.64 180 bottom
C21  9.27,11.3 0 bottom
C22  6.86,27.94 90 bottom
C23  7.24,11.3 0 bottom
C24  11.68,27.13 270 bottom
C25  11.68,5.59 270 bottom
C26  11.68,3.56 270 bottom
C27  15.62,25.65 270 bottom
C28  15.62,27.69 90 bottom
C29  23.75,25.65 270 bottom
C30  23.75,27.69 90 bottom
C31  41.91,5.71 270 bottom
C32  41.91,3.68 270 bottom
C33  35.56,25.65 270 bottom
C34  35.56,27.69 90 bottom
C35  39.75,25.65 270 bottom
C36  39.75,27.69 90 bottom
C37  56.13,28.45 0 top
C38  43.31,26.42 270 bottom
C39  40.77,27.05 90 bottom
C40  55.37,17.91 0 top
C41  55.63,14.99 270 top
CC-BY-SA  10.16,-49.53 0 top  (outside the outline)
D1  15.11,10.54 0 bottom
D2  7.75,16.26 90 bottom
D3  2.41,10.92 0 top
D4  6.6,29.59 180 top
DRILEGEND  [DRILEGEND]  96.77,62.48 0 top  (outside the outline)
F1  2.15,6.29 90 top
F2  8.38,3.81 0 top
F3  54.48,3.81 0 top
F4  52.32,29.08 0 top
F5  19.05,27.94 0 bottom
F6  54.61,6.35 0 bottom
F7  16.51,6.35 0 bottom
J1  1.4,31.75 0 top
J2  1.27,1.27 0 top
L1  5.31,4.97 270 top
L2  18.08,19.2 90 bottom
M1  28.83,16.51 270 top
R1  13.84,13.21 0 bottom
R2  11.81,13.72 180 bottom
R3  12.32,15.24 270 bottom
R4  10.92,9.78 90 bottom
R5  22.1,10.03 180 bottom
R6  5.84,14.48 90 top
R7  10.41,17.53 270 bottom
R8  5.97,21.59 90 top
R9  5.97,24.89 270 top
R10  56.13,29.46 180 top
R11  56.13,27.43 0 top
R12  50.8,24.51 0 top
R13  55.37,16.64 315 top
S1  1.45,16.51 270 top
SW1  60.33,28.57 0 top
TP1  9.02,18.67 0 bottom
TP3  4.32,23.37 0 bottom
TP4  4.95,23.88 0 bottom
TP5  6.48,24.51 0 bottom
TP6  6.99,24.89 0 bottom
TP7  9.78,25.15 0 bottom
TP8  9.91,24 0 bottom
TP10  10.29,19.56 0 bottom
TP11  9.65,19.18 0 bottom
U1  14.1,14.99 180 bottom
U2  22.61,14.86 180 bottom
U3  7.75,21.59 90 bottom
U4  11.56,22.23 0 bottom
U5  9.27,27.05 270 bottom
U6  8.38,9.53 0 bottom
U7  13.84,26.92 90 bottom
U8  13.46,4.7 270 bottom
U9  21.97,26.92 90 bottom
U10  33.78,26.92 90 bottom
U11  43.69,4.57 270 bottom
U12  37.97,26.92 90 bottom
U13  42.04,26.42 270 bottom
U$7  [DOMINO_LOGO_SMALL]  55.24,9.53 0 top
U$9  [DOMINO_LOGO_SMALL]  42.55,21.59 0 bottom
U$28  [A5L-LOC]  -40.64,-60.96 0 top  (outside the outline)
U$36  [ESD_LOGO]  53.34,5.08 0 bottom
U$38  [OPEN_HARDWARE_LOGO]  49.53,22.86 0 bottom
U$39  [RECYCLE_BIN_LOGO]  6.6,9.14 0 bottom
U$40  [ROHS_LOGO]  39.37,17.78 0 bottom
U$41  [CE_LOGO_SMALL]  57.15,9.53 0 bottom
U$42  [FCC_LOGO_SMALL]  62.87,9.53 0 bottom

### Tracks (layer width: path | path; a pad name or v marks a point on that pad's centre or on a via)
!_RESET_L  (via drill 0.2 pad 0.03)
  Top 0.203: v42.16,27.43 43.56,27.43 v43.94,27.81
  Bottom 0.203: v43.94,27.81 43.94,28.07 44.45,28.57 46.48,28.57 46.86,28.96 51.44,28.96 51.82,29.34 53.85,29.34 54.23,29.72 56.26,29.72 56.64,30.1 58.67,30.1 59.05,30.48 61.09,30.48 J1.25 | v42.16,27.43 42.16,27.42 U13.8
!_USB_UART
  Bottom 0.203: 7.61,9.91 U6.10 6.71,9.93 2.92,13.72 2.92,19.56 2.29,20.19 2.29,22.99 5.84,26.54 5.84,29.84 J1.2
!RESET_L  (via drill 0.2 pad 0.03)
  Top 0.203: v41.66,25.53 40.77,26.42 40.77,27.56 40.77,27.57 40.77,28.96 M1.4
  Bottom 0.203: U13.5 41.69,25.56 v41.66,25.53
!USB_UART  (via drill 0.2 pad 0.03)
  Top 0.203: v9.27,25.78 10.79,25.78 v11.56,25.02 | v11.94,10.16 11.94,20.07 v12.19,20.32
  Bottom 0.203: U5.6 8.96,26.73 9.27,26.42 v9.27,25.78 | v11.56,25.02 11.56,22.48 12.21,21.83 U4.1 12.21,20.34 v12.19,20.32 | U6.2 9.42,9.93 9.78,10.29 10.79,10.29 R4.2 v11.94,10.16
+2.5VD_OUT
  Top 0.203: M1.23 8.27,20.57
  Top 0.406: R8.2 6.1,22.23 7.75,20.57 8.27,20.57
+2V5  (via drill 0.2 pad 0.03)
  Top 0.203: v44.32,26.29 45.34,27.3 47.5,27.3 47.88,27.69 54.36,27.69 55.24,28.57 55.24,28.96 R10.2
  Top 0.406: 35.56,22.23 39.75,22.23 39.75,22.35 | 39.75,22.35 v39.75,22.86 | v35.56,22.86 35.56,22.23 | 35.56,22.23 23.75,22.23 | 23.75,22.23 v23.75,22.86 | v15.62,24.64 15.62,22.23 | 6.99,19.04 v7,19.05 | 13.34,8.26 22.86,8.26 | 22.86,8.26 41.02,8.26 v41.91,7.37 | 13.34,8.26 v13.34,11.3 v13.34,22.23 | 23.75,22.23 15.62,22.23 | 15.62,22.23 v13.34,22.23 | v13.34,22.23 12.7,22.23 10.03,19.56 7,19.56 v7,19.05 | v12.45,7.49 12.57,7.49 13.34,8.26 | R8.1 5.97,20.67 U3.5 v7,19.05 | v43.31,22.23 39.88,22.23 39.75,22.35 | v22.73,8.89 22.73,8.38 22.86,8.26
  Bottom 0.203: U11.12 42.86,5.3 U11.1 42.84,5.8 42.55,6.1 C31.1 | U8.1 12.64,5.42 U8.12 | U6.1 9.11,10.35 | U6.1 9.14,10.39 | U6.12 8.41,10.38 U6.1 | U3.5 v7,19.05 | 12.21,23.5 U4.5 | U7.12 14.69,26.9 U7.1 14.69,25.57 14.99,25.27 C27.2 | U9.12 22.82,26.9 U9.1 22.82,25.57 23.11,25.27 C29.2 23.5,25.27 | U10.12 34.63,26.9 U10.1 34.63,25.69 35.05,25.27 C33.2 | U12.12 38.82,26.9 U12.1 38.82,25.57 39.12,25.27 C35.2 | U6.1 9.36,10.38 9.65,10.67 C21.1 | 12.61,5.21 U8.1 | C25.1 12.09,5.97 U8.1 | U13.6 U13.3 42.72,26.24 42.93,26.04 C38.2 44.07,26.04 v44.32,26.29
  Bottom 0.406: v35.56,22.86 C33.2 | C29.2 v23.75,22.86 | C27.2 v15.62,24.64 | v13.34,22.23 C15.2 12.8,22.73 U4.5 12.21,24.37 12.09,24.49 12.09,25.76 11.68,26.16 C24.2 11.66,26.73 U5.3 | v7,19.05 7,18.93 C11.1 | v41.91,7.37 C31.1 | C25.1 11.68,6.73 v12.45,7.49 | C21.1 v13.34,11.3 | C35.2 v39.75,22.86 | C38.2 v43.31,22.23 | R5.2 v22.73,8.89
+2VA_ETH_OUT
  Top 0.178: M1.40 29.01,4.01 J2.13
+3.3VD_IN  (via drill 0.2 pad 0.03)
  Top 0.203: M1.26 7.98,14.86 R6.2
  Top 0.254: v10.41,14.61 10.32,14.51 M1.26
  Top 1.016: M1.25 M1.26
  Bottom 0.203: R7.2 v10.41,14.61
+3V3  (via drill 0.2 pad 0.03)
  Top 0.61: M1.24 10.26,18.51 v10.41,18.67 | v18.03,19.3 v21.72,19.3 34.04,19.3 48.26,5.08 50.8,5.08 J2.22
  Bottom 0.203: U1.4 12.43,15.74 R3.1
  Bottom 0.406: U2.3 23.56,15.05 23.11,14.61 22.48,14.61 21.66,15.43 U2.1 21.72,16.22 C10.1 v21.72,19.3 | v18.03,19.3 17.37,19.3 L2.2
  Bottom 0.61: C7.2 R3.1 12.32,16.38 C14.1 | C14.1 12.57,17.65 C19.1 11.56,18.29 | 11.56,18.29 11.56,18.84 C18.1 | 11.56,18.29 11.43,18.16 R7.1 v10.41,18.67 | L2.2 17.26,19.04 15.37,17.14 C16.1 C14.1
+5V  (via drill 0.2 pad 0.03)
  Top 0.61: J1.1 0.76,31.11 0.76,25.65 2.92,23.5 v14.35,23.5
  Bottom 0.203: U1.7 15.11,14.74 C3.1
  Bottom 0.406: R1.1 14.73,13.21 15.49,13.97 C3.1
  Bottom 0.61: C2.1 17.4,13.97 C3.1 | C2.1 17.65,13.97 C5.1 20.45,15.24 20.45,20.83 17.78,23.5 v14.35,23.5 | D1.1 17.53,11.3 C2.1
+VIO  (via drill 0.2 pad 0.03)
  Top 0.406: J1.15 38.35,30.35 39.24,30.35 39.75,29.84 v39.75,26.67 | v6.99,10.54 6.99,11.05 7.37,11.43 9.53,11.43 10.79,10.16 v10.79,6.86 | v13.46,30.35 17.27,30.35 17.78,29.84 17.78,26.29 v17.84,26.23
  Bottom 0.178: 35.05,27.56 35.31,27.3 C34.1 | U7.11 14.76,27.56 15.11,27.56 15.37,27.3 C28.1
  Bottom 0.203: U10.11 34.7,27.56 35.05,27.56 | U8.11 C26.1 | U12.11 39.13,27.67 39.5,27.3 C36.1 v39.75,26.67 | v6.99,10.54 7.2,10.32 U6.11 C23.1 | C30.1 23.37,27.3 23,27.67 U9.11 | C32.1 42.65,4.06 U11.11 | U13.7 40.85,26.59 C39.1
  Bottom 0.406: C28.1 16.76,27.3 v17.84,26.23 21.84,22.23 24.38,22.23 | C30.1 24.38,26.67 24.38,22.23 | 36.2,22.23 36.2,26.67 C34.1 | C32.1 41.27,4.06 40.77,4.57 40.77,7.49 40.01,8.26 26.67,8.26 | C26.1 11.29,3.95 10.79,4.45 v10.79,6.86 12.19,8.26 26.67,8.26 | 36.2,22.23 40.13,22.23 40.77,22.86 C39.1 v39.75,26.67 | C22.1 7.04,27.38 U5.7 8.83,27.38 9.27,27.81 9.27,28.45 11.18,30.35 v13.46,30.35 | 26.67,22.23 26.67,8.26 | 26.67,22.23 36.2,22.23 | 24.38,22.23 26.67,22.23
+VUSB  (via drill 0.2 pad 0.03)
  Top 0.61: 5.27,6.35 L1.1 5.91,5.71 v7.11,5.71
  Bottom 0.61: v7.11,5.71 8.64,5.71 11.81,8.89 12.76,8.89 D1.2
_FLASH_WP
  Bottom 0.203: J1.24 58.55,30.48 56.52,30.48 56.13,30.1 54.1,30.1 53.72,29.72 51.69,29.72 51.31,29.34 46.74,29.34 46.35,28.96 44.32,28.96 42.39,27.02 U13.1
_GPIO24
  Bottom 0.203: U6.9 7.11,9.53 5.71,8.13 5.71,3.05 5.21,2.54 2.54,2.54 J2.1
_I2S_CK
  Bottom 0.203: U8.10 13.06,3.16 12.45,2.54 10.16,2.54 J2.4
_I2S_MCK
  Bottom 0.203: J2.7 16,1.27 14.26,3.01 U8.7
_I2S_MICIN
  Bottom 0.203: U6.7 7.33,8.72 6.48,7.87 6.48,1.4 J2.3
_I2S_SD
  Bottom 0.203: U8.8 13.86,1.38 J2.6
_I2S_WS
  Bottom 0.203: U8.9 13.46,2.92 11.81,1.27 J2.5
_JTAG_TCK
  Bottom 0.203: J1.18 43.31,30.48 41.27,30.48 40.89,30.1 38.86,30.1 38.48,29.72 35.43,29.72 33.78,28.07 U10.9
_JTAG_TDI
  Bottom 0.203: J1.17 40.77,30.48 38.73,30.48 38.35,30.1 35.31,30.1 33.38,28.18 U10.8
_JTAG_TDO
  Bottom 0.203: J1.16 38.23,30.48 35.18,30.48 32.98,28.28 U10.7
_JTAG_TMS
  Bottom 0.203: J1.19 45.85,30.48 43.81,30.48 43.43,30.1 41.4,30.1 41.02,29.72 38.99,29.72 38.61,29.34 35.56,29.34 34.18,27.96 U10.10
_LED0
  Bottom 0.203: U7.7 13.04,28.66 14.1,29.72 J1.6
_LED1
  Bottom 0.203: U7.8 13.44,28.56 J1.7
_LED2
  Bottom 0.203: J1.8 17.91,30.48 15.88,30.48 13.84,28.45 U7.9
_LED3
  Bottom 0.203: J1.9 20.45,30.48 18.54,30.48 18.16,30.1 16,30.1 14.24,28.34 U7.10
_LED4
  Bottom 0.203: U9.7 21.17,28.66 J1.10
_LED5
  Bottom 0.203: J1.11 25.53,30.48 23.5,30.48 21.57,28.56 U9.8
_LED6
  Bottom 0.203: J1.12 28.07,30.48 26.04,30.48 25.65,30.1 23.62,30.1 21.97,28.45 U9.9
_LED7
  Bottom 0.203: J1.13 30.61,30.48 28.57,30.48 28.19,30.1 26.16,30.1 25.78,29.72 23.75,29.72 22.37,28.34 U9.10
_LED8  (via drill 0.2 pad 0.03)
  Top 0.203: v35.99,28.83 35.99,30.18 J1.14
  Bottom 0.203: v35.99,28.83 36.7,28.83 37.17,28.36 U12.7
_SPDIF_OUT
  Bottom 0.203: U6.8 7.22,9.12 6.1,8 6.1,2.79 4.57,1.27 J2.2 3.81,1.14
_SPI_CLK
  Bottom 0.203: J2.21 52.07,1.65 51.18,2.54 49.4,2.54 49.02,2.92 47.24,2.92 46.86,3.3 44.7,3.3 44.49,3.52 U11.7
_SPI_CS
  Bottom 0.203: U11.9 43.69,3.3 44.45,2.54 46.35,2.54 46.99,1.91 J2.19
_SPI_MISO
  Bottom 0.203: U11.10 43.29,3.19 44.45,2.03 J2.18
_SPI_MOSI
  Bottom 0.203: U11.8 44.09,3.41 44.58,2.92 46.61,2.92 46.99,2.54 48.77,2.54 49.53,1.78 J2.20
_UART_CTS
  Bottom 0.203: U12.9 37.97,28.32 38.23,28.57 38.86,28.57 39.24,28.96 41.27,28.96 41.66,29.34 43.69,29.34 44.07,29.72 46.1,29.72 46.48,30.1 51.05,30.1 51.44,30.48 53.47,30.48 J1.22
_UART_RTS
  Bottom 0.203: U12.10 38.37,28.09 38.48,28.19 38.99,28.19 39.37,28.57 41.4,28.57 41.78,28.96 43.81,28.96 44.2,29.34 46.23,29.34 46.61,29.72 51.18,29.72 51.56,30.1 53.59,30.1 53.98,30.48 56.01,30.48 J1.23
_UART_RX
  Bottom 0.203: U5.8 8.1,30.13 J1.3 6.57,31.66
_UART_TX  (via drill 0.2 pad 0.03)
  Top 0.203: v11.68,28.19 11.68,29.72 10.92,30.48 10.29,30.48 J1.4
  Bottom 0.203: U5.1 11.52,28.03 v11.68,28.19
_XLNA
  Bottom 0.203: U12.8 37.57,28.43 38.1,28.96 38.73,28.96 39.12,29.34 41.15,29.34 41.53,29.72 43.56,29.72 43.94,30.1 45.97,30.1 46.35,30.48 50.93,30.48 J1.21
ANT0
  Top 0.406: 50.16,24.51 R12.1
  Top 0.66: M1.59 50.16,24.51
ANT0_50R
  Top 0.406: 59.57,15.37 59.18,15.37 | R13.2 55.64,16.27 55.63,16.26
  Top 0.61: 55.64,15.38 arc-90 C41.1 | 59.57,15.37 arc-90 A1.FEED
  Top 0.66: 56.54,15.37 C41.1 55.63,16.26
  Top 1.2: 59.18,15.37 56.54,15.37
ANT0_EXT
  Top 0.406: 51.44,24.51 R12.2 | 54.99,17.02 R13.1
  Top 0.66: 54.99,17.02 C40.1 54.99,23.88 arc90 54.36,24.51 51.44,24.51
BLUE_LED
  Top 0.203: R9.1 5.97,29.46 D4.2
D+  (via drill 0.2)
  Top 0.254: S1.3 5.33,16.51 v5.46,16.38
  Bottom 0.203: U3.3 8,17.91 8.69,17.22 D2.3
  Bottom 0.254: D2.3 8.58,17.22 7.75,16.38 v5.46,16.38
D-  (via drill 0.2)
  Top 0.254: S1.2 5.45,17.16 v5.46,17.14
  Bottom 0.203: U3.4 7.5,17.89 6.82,17.22 D2.2
  Bottom 0.254: 6.17,17.22 D2.2 6.58,17.14 v5.46,17.14
EN
  Bottom 0.203: R1.2 13.46,14.12 U1.1
FB
  Bottom 0.203: U1.2 12.44,14.74 R3.2
  Bottom 0.406: C7.1 R3.2 12.19,14.73 R2.2
FLASH_WP  (via drill 0.2 pad 0.03)
  Top 0.203: v42.42,21.21 42.42,12.32 48.23,6.51 M1.50
  Bottom 0.203: U13.4 42.39,21.24 v42.42,21.21
GND  (via drill 0.2 pad 0.03)
  Bottom 0.203: C34.2 36.01,28.07 U12.6 | U13.2 42.72,26.59 42.93,26.8 C38.1 | U3.2 8.5,20.84 U3.PAD
  Bottom 0.254: C9.2 C8.2
  Bottom 0.406: U5.2 11.55,27.38 C24.1 | C11.2 5.84,18.8 v6.1,19.05 | v11.68,4.57 C25.2
  other vias: 60.96,27.94 45.72,27.94 27.94,27.94 5.08,27.94 7.62,25.4 17.78,25.4 20.32,25.4 25.4,25.4 27.94,25.4 30.48,25.4 45.72,25.4 48.26,25.4 50.8,25.4 53.34,25.4 55.88,25.4 58.42,25.4 60.96,25.4 60.96,22.86 58.42,22.86 55.88,22.86 53.34,22.86 50.8,22.86 45.72,22.86 20.32,22.86 15.24,20.32 22.86,17.78 25.4,20.32 27.94,20.32 30.48,20.32 33.02,20.32 35.56,20.32 38.1,20.32 40.64,20.32 45.72,20.32 50.8,20.32 53.34,20.32 55.88,20.32 58.42,20.32 60.96,20.32 53.34,17.78 50.8,17.78 43.18,17.78 40.64,17.78 38.1,17.78 33.02,17.78 30.48,17.78 27.94,17.78 25.4,17.78 22.86,15.24 5.08,15.24 22.86,12.7 25.4,15.24 27.94,15.24 30.48,15.24 33.02,15.24 35.56,15.24 40.64,15.24 43.18,15.24 45.72,15.24 48.26,15.24 50.8,15.24 53.34,15.24 60.96,12.7 58.42,12.7 55.88,12.7 53.34,12.7 50.8,12.7 45.72,12.7 38.1,12.7 35.56,12.7 33.02,12.7 27.94,12.7 25.4,12.7 20.32,12.7 15.24,12.7 12.7,10.16 20.32,10.16 27.94,10.16 30.48,10.16 33.02,10.16 35.56,10.16 38.1,10.16 40.64,10.16 53.34,10.16 55.88,10.16 58.42,10.16 60.96,10.16 58.42,7.62 55.88,7.62 50.8,7.62 43.18,7.62 7.62,7.62 7.62,5.08 10.16,5.08 17.78,5.08 45.72,5.08 53.34,5.08 58.42,5.08 55.88,2.54 17.78,2.54 7.62,2.54 50.8,23.5 48.26,23.5 47.62,24.13 47.62,24.77 49.53,25.4 49.53,23.5 52.07,25.4 52.07,23.5 54.61,25.4 53.34,23.5 55.88,24.13 53.98,23.5 55.88,21.59 53.98,21.59 53.98,22.86 53.98,20.32 53.98,19.05 55.88,19.05 53.98,17.78 53.98,16.51 54.61,15.88 54.61,15.24 54.61,13.97 55.24,13.34 55.88,13.34 57.15,13.34 58.42,13.34 59.69,12.7 62.23,12.7 62.23,20.32 59.69,20.32 58.42,19.68 57.15,19.68 55.88,19.68 55.24,25.4 55.88,24.77 41.91,27.94 36.32,27.56 23.5,26.67 20.32,26.67 12.27,26.92 6.86,28.96 8.89,30.48 3.3,22.61 10.92,19.56 11.43,16.51 13.97,15.24 7.75,21.59 35.56,26.42 36.83,24.13 38.1,22.86 33.02,22.86 30.48,22.86 27.94,22.86 25.4,22.86 22.86,22.86 38.1,7.62 35.56,7.62 33.02,7.62 30.48,7.62 27.94,7.62 25.4,7.62 22.86,7.62 20.32,7.62 17.78,7.62 15.24,7.62 40.13,26.04 43.18,20.32 45.72,17.78 45.72,10.16 48.26,7.62 43.18,12.7 37.97,26.92 30.48,12.7 25.4,10.16 22.86,20.32 55.88,5.08 53.34,7.62 58.42,2.54 60.96,2.54
  pour Top: 0,33 64,33 64,0 0,0
  pour Bottom: 0,33 64,33 64,0 0,0
GPIO24  (via drill 0.2)
  Top 0.203: v10.03,9.78 9.3,10.51 M1.28
  Bottom 0.203: U6.3 9.78,9.53 v10.03,9.78
I2S_CK  (via drill 0.2)
  Top 0.203: v14.86,6.73 14.86,6.22 16.83,4.25 M1.34
  Bottom 0.203: v14.86,6.73 14.26,6.13 U8.5
I2S_MCK  (via drill 0.2)
  Top 0.203: v12.57,6.73 10.83,4.99 M1.31
  Bottom 0.203: U8.2 13.06,6.24 v12.57,6.73
I2S_MICIN  (via drill 0.2)
  Top 0.203: v10.03,8.26 10.03,7.37 9.18,6.51 M1.30
  Bottom 0.203: v10.03,8.26 9.56,8.72 U6.5
I2S_SD  (via drill 0.2)
  Top 0.203: v13.34,6.73 13.34,4.52 M1.32
  Bottom 0.203: U8.3 13.46,6.6 v13.34,6.73
I2S_WS  (via drill 0.2)
  Top 0.203: v14.1,6.73 14.1,4.74 M1.33
  Bottom 0.203: U8.4 13.86,6.5 v14.1,6.73
JTAG_TCK  (via drill 0.2)
  Top 0.203: 34.8,28.98 M1.7 33.91,28.09 v33.91,24.89
  Bottom 0.203: U10.3 33.78,25.02 v33.91,24.89
JTAG_TDI  (via drill 0.2)
  Top 0.203: v33.27,24.89 33.27,28.57 M1.8
  Bottom 0.203: U10.4 33.38,25 v33.27,24.89
JTAG_TDO  (via drill 0.2)
  Top 0.203: v32.64,24.89 32.64,27.2 M1.9
  Bottom 0.203: v32.64,24.89 32.98,25.23 U10.5
JTAG_TMS  (via drill 0.2)
  Top 0.203: v34.54,24.89 34.54,26.73 M1.6
  Bottom 0.203: U10.2 34.18,25.25 v34.54,24.89
JUMPSTART
  Top 0.203: R10.1 58.06,29.46 SW1.1
LED0  (via drill 0.2)
  Top 0.203: v12.7,24.89 12.7,27.18 12.19,27.69 10.79,27.69 | R9.2 6.73,25.02 6.73,25.91 6.6,26.04 6.6,26.92 7.37,27.69 10.79,27.69 | M1.19 10.79,29.01 10.79,27.69
  Bottom 0.203: v12.7,24.89 13.04,25.23 U7.5
LED1  (via drill 0.2)
  Top 0.203: v13.34,24.89 13.34,28.5 M1.18
  Bottom 0.203: U7.4 13.44,25 v13.34,24.89
LED2  (via drill 0.2)
  Top 0.203: v13.97,24.89 13.97,28.15 M1.17
  Bottom 0.203: v13.97,24.89 13.84,25.02 U7.3
LED3  (via drill 0.2)
  Top 0.203: v14.61,24.89 14.61,26.79 M1.16
  Bottom 0.203: v14.61,24.89 14.24,25.25 U7.2
LED4  (via drill 0.2)
  Top 0.203: v20.83,24.89 20.83,27.01 M1.15
  Bottom 0.203: U9.5 21.17,25.23 v20.83,24.89
LED5  (via drill 0.2)
  Top 0.203: v21.46,24.89 21.46,28.38 M1.14
  Bottom 0.203: U9.4 21.57,25 v21.46,24.89
LED6  (via drill 0.2)
  Top 0.203: v22.1,24.89 22.1,28.28 M1.13
  Bottom 0.203: U9.3 21.97,25.02 v22.1,24.89
LED7  (via drill 0.2)
  Top 0.203: v22.73,24.89 22.73,26.91 M1.12
  Bottom 0.203: U9.2 22.37,25.25 v22.73,24.89
LED8  (via drill 0.2)
  Top 0.203: v36.83,24.89 35.94,24 31.24,24 26.83,28.42 M1.11
  Bottom 0.203: v36.83,24.89 37.17,25.23 U12.5
N$1
  Top 0.203: R6.1 3.17,11.43 D3.2
N$6
  Bottom 0.203: U3.1 9,18.69 TP1.1
N$8
  Bottom 0.203: 4.33,23.36 TP3.1
  Bottom 0.254: U3.11 5.35,22.34 5.08,22.61 5.08,23.11 4.83,23.37 TP3.1
N$9
  Bottom 0.203: 4.97,23.86 TP4.1
  Bottom 0.254: U3.12 5.8,23.03 TP4.1
N$10
  Bottom 0.203: TP7.1 9.78,24.64 9.02,23.88 9.02,23.56 U3.18
N$12
  Bottom 0.203: U3.23 10.15,20.84 10.29,20.7 TP10.1
N$13
  Bottom 0.203: U3.24 9.7,19.22 TP11.1
N$14
  Bottom 0.203: U3.19 9.7,23.79 TP8.1
N$15
  Bottom 0.203: U3.14 TP6.1
N$16
  Bottom 0.203: U3.13 6.5,24.49 TP5.1
N$31
  Bottom 0.203: U3.16 C20.1
P0_RX+
  Top 0.178: M1.41 32.3,2.54 33.02,2.54 J2.14
P0_RX-
  Top 0.178: J2.15 35.56,2.54 34.3,2.54 M1.42
P0_TX+
  Top 0.178: J2.16 38.1,2.54 36.3,2.54 M1.43
P0_TX-
  Top 0.178: J2.17 40.64,2.54 38.73,2.54 38.23,3.05 37.72,3.05 36.83,3.94 M1.44
P4_RX+
  Top 0.178: M1.36 20.83,2.03 J2.9
P4_RX-
  Top 0.178: M1.37 22.83,2.57 J2.10
P4_TX+
  Top 0.178: M1.38 24.83,3.11 J2.11
P4_TX-
  Top 0.178: M1.39 26.83,3.65 J2.12
PE
  Top 1.016: S1.S$2 S1.S$3 S1.S$1 C1.1
SPDIF_OUT  (via drill 0.2)
  Top 0.203: v10.03,9.02 9.53,8.51 M1.29
  Bottom 0.203: U6.4 9.93,9.12 v10.03,9.02
SPI_CLK  (via drill 0.2)
  Top 0.203: v42.93,6.73 42.93,6.11 M1.46
  Bottom 0.203: U11.2 43.29,6.37 v42.93,6.73
SPI_CS  (via drill 0.2)
  Top 0.203: v44.2,6.73 44.2,4.7 44.83,4.06 M1.48
  Bottom 0.203: U11.4 44.09,6.62 v44.2,6.73
SPI_MISO  (via drill 0.2)
  Top 0.203: M1.49 46.83,4.73 45.97,5.59 45.34,5.59 44.83,6.1 v44.83,6.73
  Bottom 0.203: U11.5 44.49,6.39 v44.83,6.73
SPI_MOSI  (via drill 0.2)
  Top 0.203: v43.56,6.73 43.56,4.83 42.8,4.06 42.8,4.04 M1.47
  Bottom 0.203: U11.3 43.69,6.6 v43.56,6.73
SW
  Bottom 0.203: U1.6 15.55,15.24 15.6,15.19
  Bottom 0.61: L2.1 19.28,18.83 19.28,15.95 18.52,15.19 15.6,15.19
TXD
  Bottom 0.203: U3.21 10.16,21.84 10.29,21.97 11.43,21.97 11.56,21.84 U4.2
UART_CTS  (via drill 0.2)
  Top 0.203: v38.1,24.89 38.73,24.26 43.58,24.26 M1.56
  Bottom 0.203: U12.3 37.97,25.02 v38.1,24.89
UART_RTS  (via drill 0.2, 0.2 pad 0.03)
  Top 0.203: v37.47,24.89 38.48,23.88 43.43,23.88 44.32,22.99 | 44.32,22.99 48.01,19.3 48.01,17.83 M1.55 | SW1.3 57.81,27.43 R11.2 56.52,27.56 55.75,28.32 C37.1 55.63,28.45 54.48,27.3 48.13,27.3 47.62,26.8 45.47,26.8 v44.32,25.65 | v44.32,22.86 44.32,22.99
  Bottom 0.203: U12.4 37.57,25 v37.47,24.89 | v44.32,25.65 v44.32,22.86
UART_RX  (via drill 0.2 pad 0.03)
  Top 0.203: v10.91,24.91 10.54,25.27 8.51,25.27 v8.13,25.65 8.13,26.31 M1.20
  Bottom 0.203: U5.5 8.1,25.69 v8.13,25.65 | v10.91,24.91 U4.4
UART_TX  (via drill 0.2 pad 0.03)
  Top 0.203: 8.76,24.51 8.51,24.51 M1.21 | 8.76,24.51 v10.41,24.51 | 8.76,24.51
  Bottom 0.203: U3.20 9.71,22.35 10.29,22.35 10.41,22.48 v10.41,24.51 10.41,26.04 U5.4
USB_N
  Top 0.254: J2.24 59.69,2.4 50.35,11.73 49.66,11.73 49.33,11.41 M1.52
USB_P
  Top 0.254: J2.25 61.38,1.27 50.14,12.51 M1.53
VBUS  (via drill 0.2, 0.2 pad 0.03)
  Top 0.406: v5.71,20.02 5.46,19.76 v5.46,17.78 5.43,17.81 S1.1
  Top 0.61: C4.1 5.71,10.72 5.71,11.77 C6.1 5.45,11.95 v5.33,12.06
  Top 1.016: C4.1 4.64,10.36 3.11,8.83 F1.2
  Bottom 0.203: 5.8,20.57 U3.8
  Bottom 0.254: 5.8,20.32 U3.7 U3.8 5.32,20.84 C12.1 C13.1 | D2.4 8.69,15.3
  Bottom 0.406: v5.71,20.02 5.71,20.26 U3.7
  Bottom 0.61: 8.69,15.3 8.69,15.17 7.87,14.35 v4.95,14.35 | v4.95,14.35 4.06,15.24 4.06,16.89 4.95,17.78 v5.46,17.78 | v4.95,14.35 4.95,12.45 v5.33,12.06
VDD
  Bottom 0.203: C9.1 C8.1
  Bottom 0.254: C8.1 6.42,19.56 U3.6
VOUT
  Bottom 0.406: U2.5 21.66,11.74 C17.1 21.46,11.43 R5.1
VPROT
  Top 1.016: F1.1 2.28,3.62 L1.2
XLNA  (via drill 0.2)
  Top 0.203: M1.5 38.83,24.99 v38.73,24.89
  Bottom 0.203: U12.2 38.37,25.25 v38.73,24.89

### Text on the board
Top: Component side (.CMP)
Bottom: Solder Side (.SOL)
tPlace: Rev. A | Silk screen CMP (.PLC)
bPlace: TDO | +5V | !USB_UART | RX | TX | GND | 0 | 1 | 2 | 3 | 4 | 5 | 6 | 7 | 8 | +VIO | TDI | TCK | TMS | GND | XLNA | CTS | RTS | FLASH_WP | !RESET_L | Rev. A | UART | LED | JTAG | UART | FLASH | MISC | c 2014, Michel Stempin / All rights reserved. | Licensed under a Creative Commons / Attribution-Share-Alike Unported License. / See creativecommons.org/licenses/by-sa/4.0/ | I2S | ETH_P4 | ETH_P0 | SPI | USB | MISC | GPIO24 | SPDIF_OUT | MICIN | CK | WS | SD | MCK | GND | RX+ | RX- | TX+ | TX- | +2VA_ETH_OUT | RX+ | RX- | TX+ | TX- | GND | MISO | CS | MOSI | CLK | GND | - | + | Silk screen SOL (.PLS)
tStop: Solder stop mask CMP (.STC)
bStop: Solder stop mask SOL (.STS)
tCream: Cream frame CMP (.CRC)
bCream: Cream frame SOL (.CRS)
Measures: SLOT SIZE IN MM / 2x PLATED SLOT: 1.35x0.35
Document: DRILL CHART: TOP TO BOTTOM | LINE WIDTH IMPEDANCE CHART FOR REFERENCE | Class | RF | Type | Coated Coplanar Waveguide With Ground 1B | Layer | Impedance | Trace Width | Trace Separation | Ground Separation | TOP, / BOTTOM | 50 Ohms | 26 mils | N/A | 6 mils | Class | USB | Type | Diff Coated Coplanar Waveguide With Ground 1B | Layer | Impedance | Trace Width | Trace Separation | Ground Separation | TOP, / BOTTOM | 90 Ohms | 10 mils | 5 mils | 5 mils | Class | Ethernet | Type | Diff Coated Coplanar Waveguide With Ground 1B | Layer | Impedance | Trace Width | Trace Separation | Ground Separation | TOP, / BOTTOM | 100 Ohms | 7 mils | 5 mils | 6 mils | STACK-UP FOR REFERENCE | LAYER 1 L1 TOP | 18 UM CU + 12.5 UM PLATING (30.5 UM) | 1.061 MM+/-10% | CORE | 1.0 MM CORE FR-4 LG 135 / INCLUDING COPPER | LAYER 4 L16 BOTTOM | 18 UM CU + 12.5 UM PLATING (30.5 UM) | NOTES: | 1. PRINTED CIRCUIT BOARD MADE FROM NEMA GRADE FR-4 TG 135 EPOXY / LAMINATE WITH 35 UM COPPER PLATING AND 1 MM THICKNESS. | 2. ALL DIMENSIONS ARE GIVEN IN MILLIMETERS EXCEPT TRACE WIDTH/SPACE. | 3. CIRCUIT PATHS ARE FOR REFERENCE ONLY. | 4. HOLE SIZES SHOWN ARE FINISHED DIAMETERS AFTER PLATING. | 5. BOARD PLATED USING REFLOW OR SIMILAR METHOD. | 6. BOARD TO HAVE GREEN SOLDER MASK ON PLATED SURFACES USING WET / FILM SR100 OR SR1010 EPOXY. / EQUIVALENT WET OR DRY FILM MAY BE USED. | 7. SILKSCREEN BOARD USING WHITE INK. DISTORTION OF SILKSCREEN / IS ACCEPTABLE OVER TRACES. EPOXY INK ON PLATED LANDS IS NOT / ACCEPTABLE | 8. THE FOLLOWING INFORMATION APPLIES TO THIS BOARD: | * 2 COPPER LAYERS | * 1 MM BOARD THICKNESS | * REQUIRES TOP AND BOTTOM SIDE SILKSCREENS | © 2014, Michel Stempin. / All rights reserved. | Licensed under a Creative Commons / Attribution-Share-Alike Unported License. / See creativecommons.org/licenses/by-sa/4.0/ | Reference designs are provided "AS IS" and "WITH ALL FAULTS". / Michel Stempin disclaims all other warranties express or implied, / regarding this product, including but not limited to, any implied warranties of / merchantibility or fitness for any particular application. | Domino / Core | Domino / Pi | Domino / Qi | Michel Stempin may make changes to specifications and product descriptions / at any time, without notice. | Rev.
tDocu: Component Assembly CMP (.ASC)
bDocu: Component Assembly SOL (.ASS)
DrillLegend: LAYER-STACK
DrillLegend_01-16: 01-16 | Drill data (.DRD)
DrillLegend_01-20: 01-20
Outline: Outline (.OLN)